# EAGLE schematic sulton (EAGLE 9.5.0)
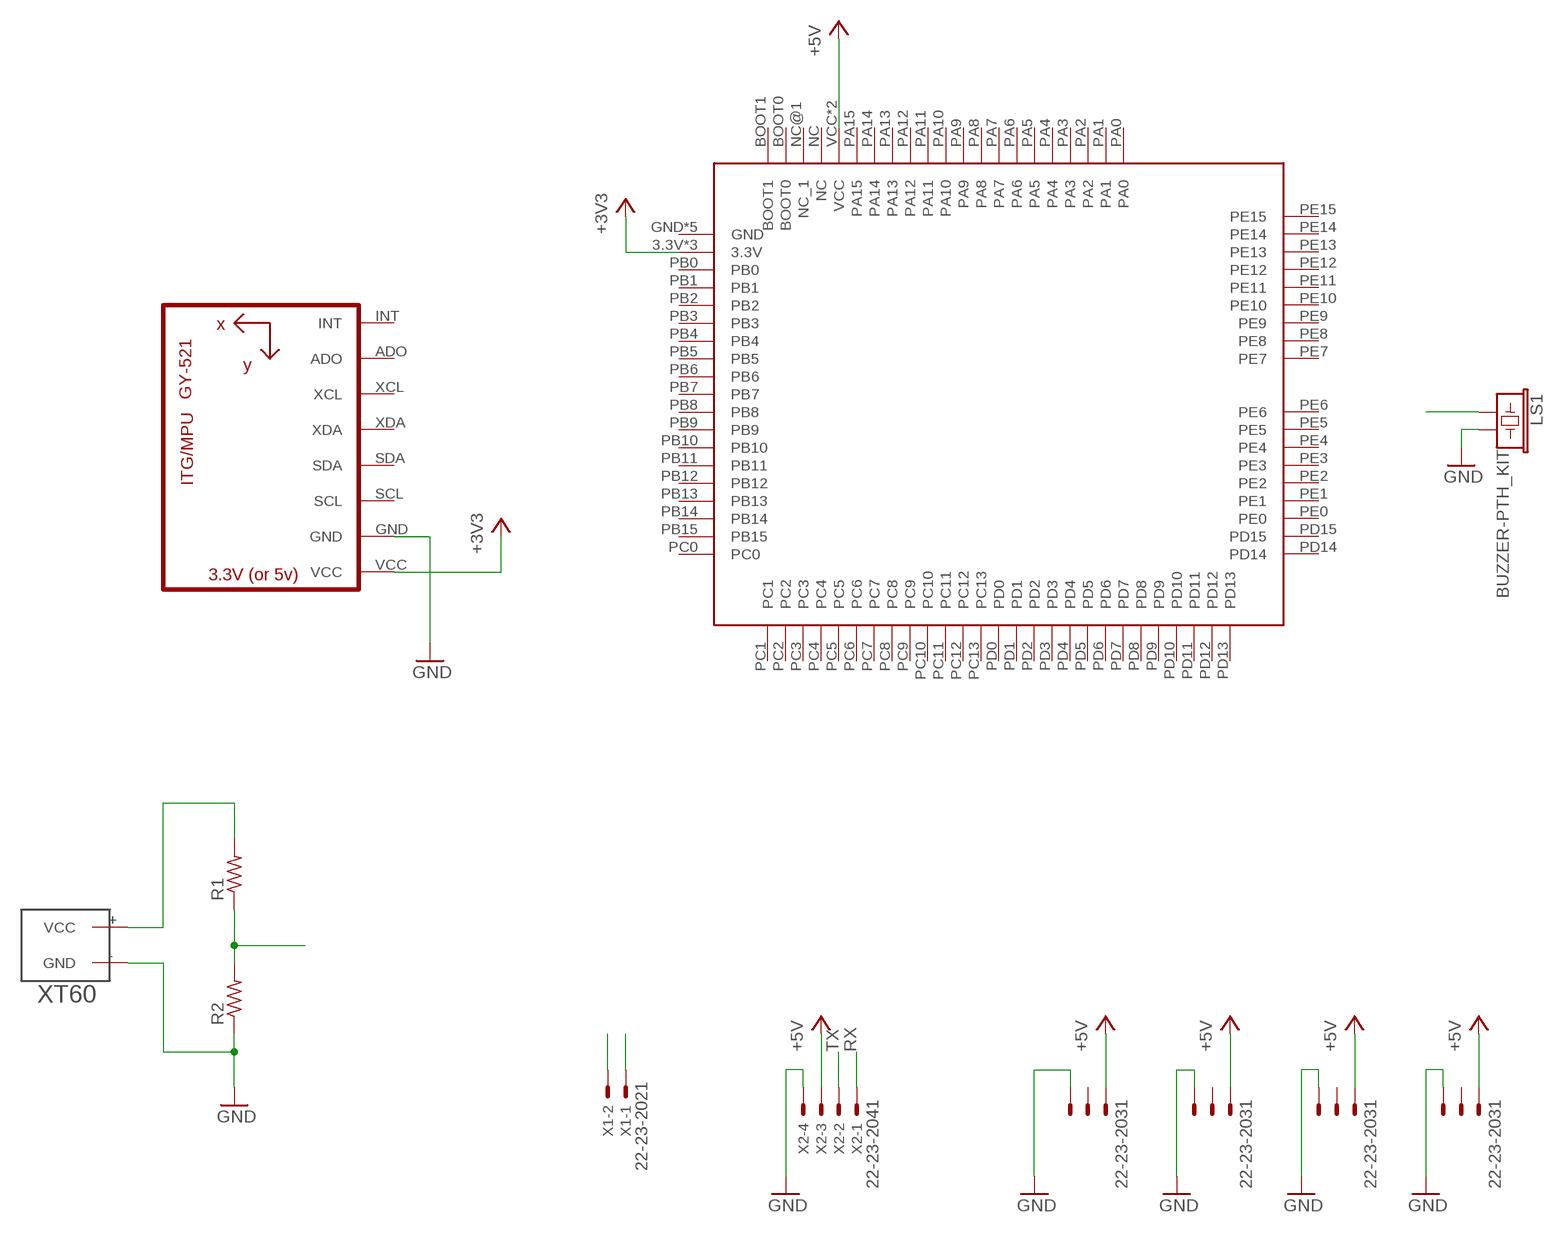
[diagram p0: schematic, sheet 1]

## Parts
ESC1  22-23-2031  [22-23-2031]
ESC2  22-23-2031  [22-23-2031]
ESC3  22-23-2031  [22-23-2031]
ESC4  22-23-2031  [22-23-2031]
LS1  BUZZER-PTH_KIT  [BUZZER-12MM-KIT]
R1  R-US_0207/10  [0207/10]
R2  R-US_0207/10  [0207/10]
U1  GY-521MPU6050  [GY-521]
U$1  STM32F4  [STM32F4]
U$2  XT60  [XT60]
X1  22-23-2021  [22-23-2021]
X2  22-23-2041  [22-23-2041]

## Nets
+3V3: U1.VCC U$1.3.3V U$1.3.3V@2(3.3V) U$1.3.3V@3(3.3V)
+5V: ESC1.1 ESC2.1 ESC3.1 ESC4.1 U$1.VCC U$1.VCC@1(VCC) X2.3
GND: ESC1.3 ESC2.3 ESC3.3 ESC4.3 LS1.- R2.1 U1.GND U$2.-(GND) X2.4
N$1: X1.2
N$2: R1.2 U$2.+(VCC)
N$3: R1.1 R2.2
N$4: X1.1
N$5: LS1.+
RX: X2.1
TX: X2.2
Unconnected: ESC1.2 ESC2.2 ESC3.2 ESC4.2 U1.ADO U1.INT U1.SCL U1.SDA U1.XCL U1.XDA U$1.BOOT0 U$1.BOOT1 U$1.GND U$1.GND@1(GND) U$1.GND@2(GND) U$1.GND@3(GND) U$1.GND@5(GND) U$1.NC U$1.NC@1(NC_1) U$1.PA0 U$1.PA1 U$1.PA2 U$1.PA3 U$1.PA4 U$1.PA5 U$1.PA6 U$1.PA7 U$1.PA8 U$1.PA9 U$1.PA10 U$1.PA11 U$1.PA12 U$1.PA13 U$1.PA14 U$1.PA15 U$1.PB0 U$1.PB1 U$1.PB2 U$1.PB3 U$1.PB4 U$1.PB5 U$1.PB6 U$1.PB7 U$1.PB8 U$1.PB9 U$1.PB10 U$1.PB11 U$1.PB12 U$1.PB13 U$1.PB14 U$1.PB15 U$1.PC0 U$1.PC1 U$1.PC2 U$1.PC3 U$1.PC4 U$1.PC5 U$1.PC6 U$1.PC7 U$1.PC8 U$1.PC9 U$1.PC10 U$1.PC11 U$1.PC12 U$1.PC13 U$1.PD0 U$1.PD1 U$1.PD2 U$1.PD3 U$1.PD4 U$1.PD5 U$1.PD6 U$1.PD7 U$1.PD8 U$1.PD9 U$1.PD10 U$1.PD11 U$1.PD12 U$1.PD13 U$1.PD14 U$1.PD15 U$1.PE0 U$1.PE1 U$1.PE2 U$1.PE3 U$1.PE4 U$1.PE5 U$1.PE6 U$1.PE7 U$1.PE8 U$1.PE9 U$1.PE10 U$1.PE11 U$1.PE12 U$1.PE13 U$1.PE14 U$1.PE15

## Library data of the parts
ESC1-ESC4 = con-molex:22-23-2031: .100" (2.54mm) Center Header - 3 Pin; MF: MOLEX; MPN: 22-23-2031; OC_FARNELL: 1462950; OC_NEWARK: 30C0862
LS1 = SparkFun-Electromechanical:BUZZER: Buzzer Small round buzzers that operate around the audible 2kHz range. You can use these as speakers to create simple music or user interfaces. Variant Overview: PTH - Mini Speaker - PC Mount 12mm 2.048kHz <https://www.sparkfun.com/products/7950> PTH_KIT - Mini Speaker - PC Mount 12mm 2.048kHz <https://www.sparkfun.com/products/7950> KIT simplifies soldering by adding stop mask to one side of the pads. PTH_NO_SILK - Mini Speaker - PC Mount 12mm 2.048kHz <https://www.sparkfun.com/products/7950> No silkscreen indicator of buzzer outline. PTH_KIT_NO_SILK - Mini Speaker - PC Mount 12mm 2.048kHz <https://www.sparkfun.com/products/7950> KIT package w/o silkscreen SMD - Buzzer Audio Magnetic (CCV-084B16) SMD buzzer used on, e.g. the LilyPad Buzzer <https://www.sparkfun.com/products/8463> and RFID USB Reader <https://www.sparkfun.com/products/9963>. SMD_KIT - Buzzer Audio Magnetic (CCV-084B16) SMD Buzzer with elongated pins to make soldering easier. Used on the SparkFun Simon Says - Surface Mount Soldering Kit <https://www.sparkfun.com/products/10935>.; PROD_ID: COMP-08253; SF_SKU: COM-07950
R1 R2 = rcl:R-US_: RESISTOR, American symbol; SPICEPREFIX: R
U1 = gy-521:GY-521
U$1 = STM32F407-2:STM32F4
U$2 = XT60:XT60: XT60
X1 = con-molex:22-23-2021: .100" (2.54mm) Center Header - 2 Pin; MF: MOLEX; MPN: 22-23-2021; OC_FARNELL: 1462926; OC_NEWARK: 25C3832
X2 = con-molex:22-23-2041: .100" (2.54mm) Center Header - 4 Pin; MF: MOLEX; MPN: 22-23-2041; OC_FARNELL: 1462920; OC_NEWARK: 38C0355